# EAGLE design pd84004 (EAGLE 5.12)
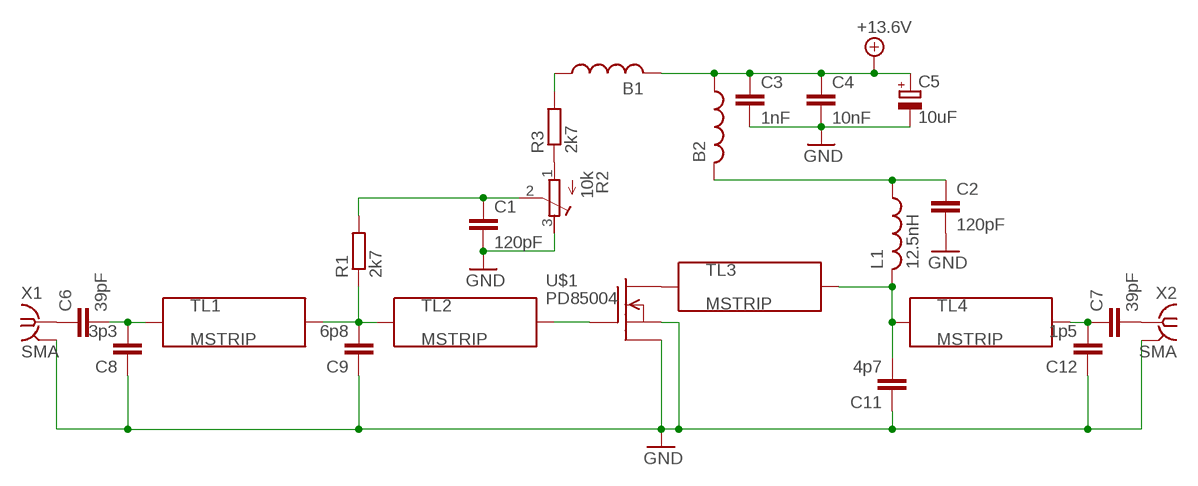
[diagram p0: schematic, sheet 1]

## Parts
B1  L-US0204/5  [0204/5]
B2  L-US0204/5  [0204/5]
C1  120pF  C-EUC0603  [C0603]
C2  120pF  C-EUC0603  [C0603]
C3  1nF  C-EUC0603  [C0603]
C4  10nF  C-EUC0603  [C0603]
C5  10uF  CPOL-EUSANYO_SMD_B6  [SANYO-OSCON_SMD_B6]
C6  39pF  C-EUC0603  [C0603]
C7  39pF  C-EUC0603  [C0603]
C8  3p3  C-EUC0603  [C0603]
C9  6p8  C-EUC0603  [C0603]
C11  4p7  C-EUC0603  [C0603]
C12  1p5  C-EUC0603  [C0603]
L1  12.5nH  L_0805  [0805]
R1  2k7  R-EU_R0805  [R0805]
R2  10k  R-TRIMM3214W  [RTRIM3214W]
R3  2k7  R-EU_R0805  [R0805]
TL1  MSTRIP  [TRLINE2]
TL2  MSTRIP  [TRLINE2]
TL3  MSTRIP  [TRLINE2]
TL4  MSTRIP  [TRLINE2]
U$1  PD85004  PD84004  [SOT-89]
X1  SMA  SMA-142-0701-881/886  [J502-ND-142-0701-881/886]
X2  SMA  SMA-142-0701-881/886  [J502-ND-142-0701-881/886]

## Nets
+12V: B1.2 B2.1 C3.1 C4.1 C5.+ ; supply symbol labelled +13.6V
GND: C1.2 C2.2 C3.2 C4.2 C5.- C8.1 C9.1 C11.1 C12.1 R2.3(A) U$1.2(S) U$1.2@1(S1) X1.G@1(GND) X2.G@1(GND)
N$1: C6.1 X1.1
N$2: B2.2 C2.1 L1.1
N$3: C7.2 X2.1
N$4: TL2.P$2 U$1.1(G)
N$5: C1.1 R1.2 R2.2(S)
N$6: C11.2 L1.2 TL3.P$2 TL4.P$1
N$7: R2.1(E) R3.1
N$8: B1.1 R3.2
N$18: C6.2 C8.2 TL1.P$1
N$19: C9.2 R1.1 TL1.P$2 TL2.P$1
N$20: C7.1 C12.2 TL4.P$2
N$21: TL3.P$1 U$1.3(D)

## Power pins joined to a net without a drawn wire
GND: X1.G@2(GND) X1.G@3(GND) X1.G@4(GND) X2.G@2(GND) X2.G@3(GND) X2.G@4(GND)

## Library data of the parts
B1 B2 = rcl:L-US: INDUCTOR, American symbol
C1-C4 C6-C9 C11 C12 = rcl:C-EU: CAPACITOR, European symbol
C5 = rcl:CPOL-EU: POLARIZED CAPACITOR, European symbol
L1 = g4bao:L_0805
R1 R3 = rcl:R-EU_: RESISTOR, European symbol
R2 = rcl:R-TRIMM: Trimm resistor
TL1-TL4 = g4bao1:MSTRIP
U$1 = g4bao1:PD84004
X1 X2 = con-coax:SMA-: SMA 50 Ohm End Launch Jack Receptacle - Round Contact Johnson Components Source: www.johnsoncomponents.com .. J502-ND.pdf

## Board
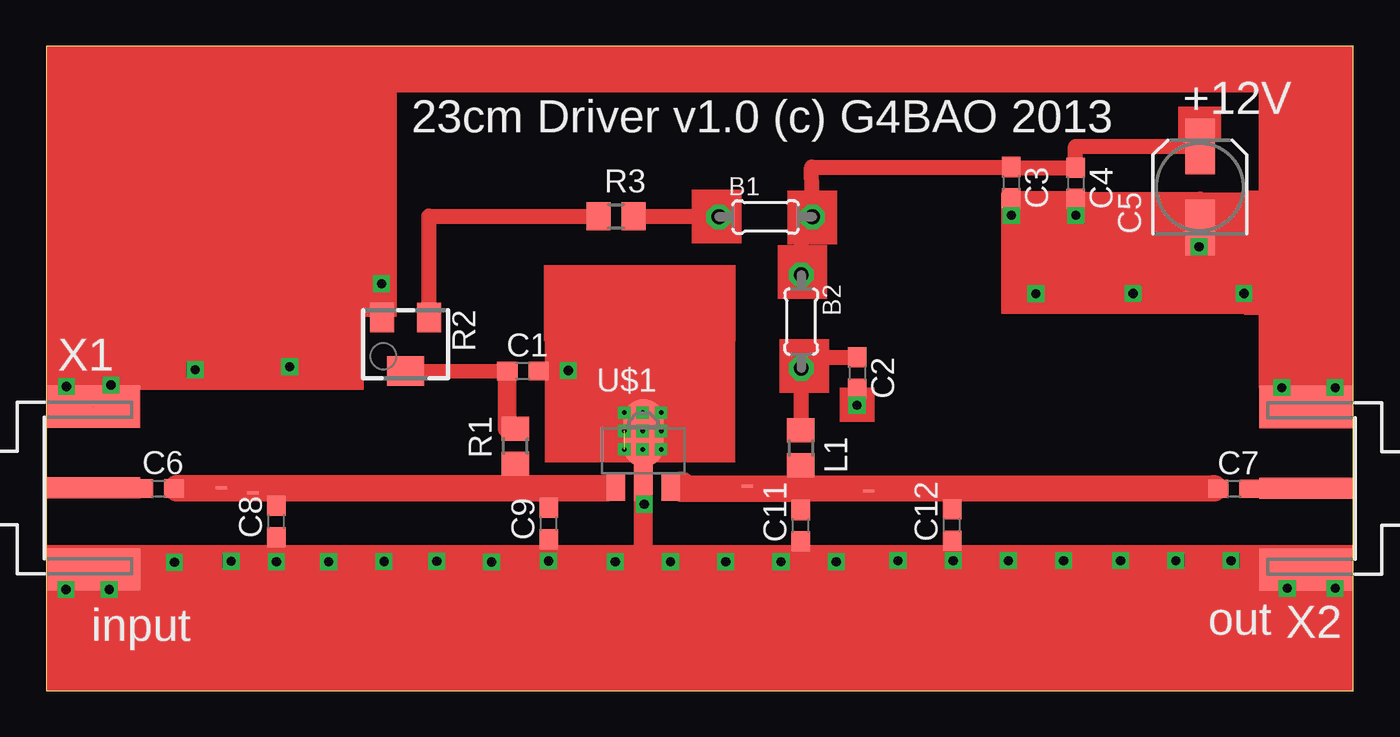
[diagram p1: board, top side]
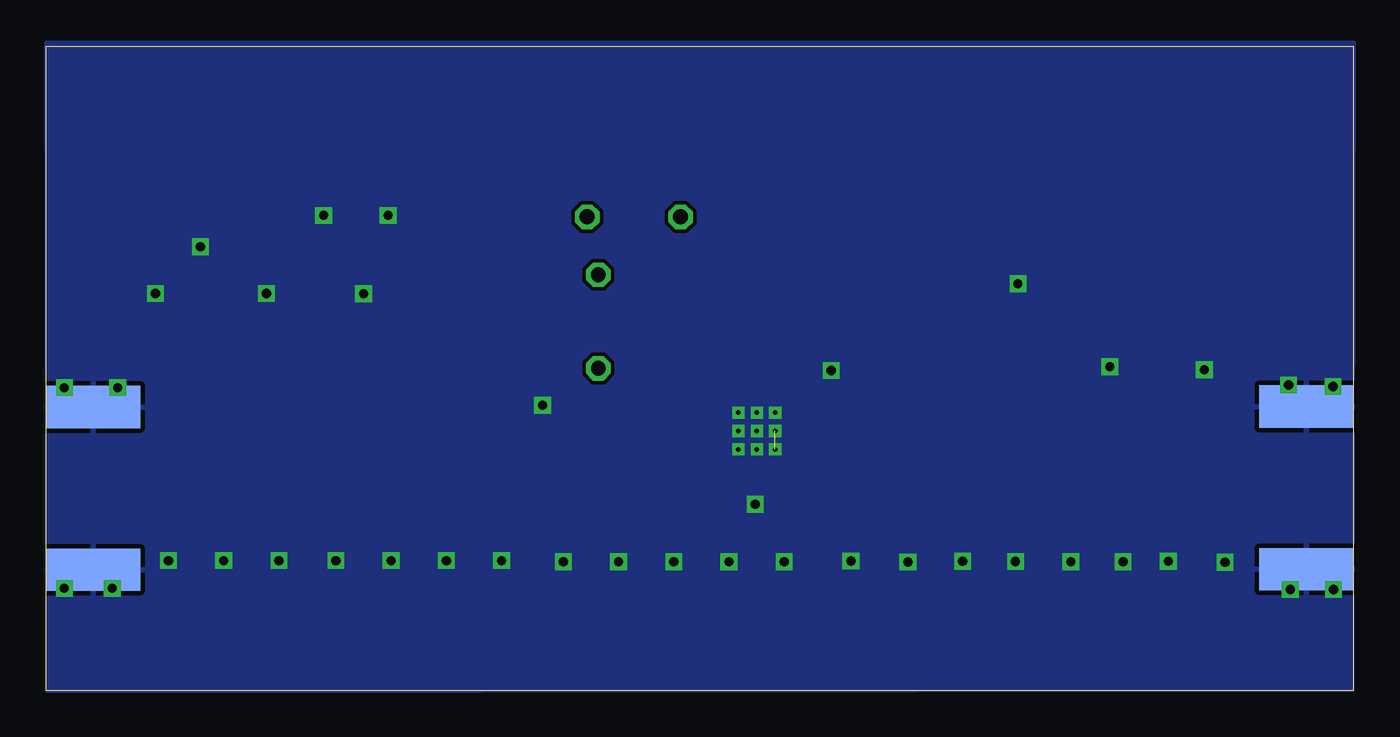
[diagram p2: board, bottom side, seen from below]

Size 71.01 x 35 mm. Coordinates in mm from the lower left corner, seen from the top.
Outline: 0.01,0 71.01,0 71.01,35 0.01,34.99 0.01,0
Copper layers (1*16): Top 0.035mm / dielectric 1.5mm / Bottom 0.035mm
Design rules "default": minimum track width 10mil, minimum drill 24mil, track to track 8mil, track to pad 8mil, pad to pad 8mil, via to via 8mil, smd to smd 8mil, copper to edge 0mil, drill to drill 8mil, minimum pad ring 10mil, minimum via ring 8mil, stop-mask expansion 4mil, vias tented up to drill 0mil, thermal gap 10mil

### Footprints (pad centres in the part's own frame; a part is rotated, then mirrored left to right if it is on the bottom)
0204/5 = drill 0.813 octagon: 1 -2.54,0; 2 2.54,0
C0603 = smd 1.1 x 1: 1 -0.85,0; 2 0.85,0
SANYO-OSCON_SMD_B6 = smd 3 x 1.6: + 2.2,0; - -2.2,0
0805 = smd 1.3 x 1.5: 1 -2.22,1.27; 2 -0.32,1.27
R0805 = smd 1.3 x 1.5: 1 -0.95,0; 2 0.95,0
RTRIM3214W = smd 1.3 x 1.6: 1 -1.275,-1.45; 3 1.275,-1.45 | smd 2 x 1.6: 2 0,1.45
TRLINE2 = smd 0.305 x 0.152: P$1 -3.139,1.555; P$2 -2.813,1.554
SOT-89 = smd 1 x 1.5: 1 -1.499,-1.981; 3 1.499,-1.981 | smd 1 x 2: 2 0,-1.727 | smd 2.2 x 3.7: 2@1 0,0.94
J502-ND-142-0701-881/886 = smd 5.08 x 1.143: 1 2.565,0 | smd 5.08 x 2.286: G@1 2.565,4.42; G@2 2.565,-4.42 | smd 5.08 x 2.286 bottom: G@3 2.565,4.42; G@4 2.565,-4.42

### Placement (x,y rotation side)
B1  39.08,25.72 0 top
B2  41.02,20.04 270 top
C1  25.9,17.36 0 top
C2  44.05,17.25 270 top
C3  52.41,27.58 270 top
C4  55.92,27.54 270 top
C5  62.67,27.35 90 top
C6  6.12,10.97 0 top
C7  64.52,10.96 0 top
C8  12.51,9.18 90 top
C9  27.31,9.07 90 top
C11  41,8.96 90 top
C12  49.21,9 90 top
L1  39.73,11.91 270 top
R1  25.49,13.28 90 top
R2  19.53,18.8 180 top
R3  30.96,25.76 0 top
TL1  14.21,9.19 0 top
TL2  12.51,9.46 0 top
TL3  41.07,9.54 0 top
TL4  47.65,9.29 0 top
U$1  32.44,13.04 0 top
X1  0,11.01 0 top
X2  71.01,10.98 180 top

### Tracks (layer width: path | path; a pad name or v marks a point on that pad's centre or on a via)
+12V
  Top 0.813: B2.1 41.02,25.72 B1.2 41.58,28.43 C3.1 52.41,28.39 C4.1 55.92,29.55 C5.+
GND  (via drill 0.25, 0.5, 0.5 pad 0.81)  (2 unrouted)
  Top 0.406: v15.35,7 15.07,7.02 16.01,7 16.82,7 | v39.92,7 41,7 C11.1 | v49.27,7.06 49.21,7.06 C12.1 | v18.22,22.1 18.15,22.1 18.15,23 | 68.42,16.45 v70.02,16.45 | 68.42,16.45 v67.12,16.45 | v67.42,5.55 68.4,5.55 68.4,5.97 | X2.G@1 64.37,6.56 v64.37,7.06 | 68.42,16.45 68.42,15.4 X2.G@4 68.4,15.4 68.4,15.35 68.35,15.35 68.35,22.6 | X1.G@4 3.03,6.56 v3.43,5.49 | X1.G@4 1.08,6.56 v1.08,5.49 | X1.G@4 2.63,6.56 2.63,6.87 2.69,6.87 2.69,6.85 6.92,6.85 v6.98,6.97 | C8.1 12.38,8.33 12.38,7.01 12.87,6.95 v12.51,7 | C9.1 27.29,8.22 v27.29,7.04 | 2.57,15.33 3.36,15.33 3.36,15.43 X1.G@1 2.57,15.33
  Top 0.813: C2.2 44.09,16.21 v44.05,15.49 | R2.3 18.15,23 18.13,23.7 18.02,23.7 | v62.63,24.11 69.73,22.6 68.35,22.6 62.71,22.6 62.71,25.15 C5.- 62.67,26.69 C4.2 55.92,26.73 C3.2 | C12.1 49.17,8.14 | v28.37,17.38 28.21,17.36 C1.2 | v32.49,10.12 32.44,8.16 U$1.2 U$1.2@1 | 16.82,7 16.82,6.1 | C11.1 41.07,8.11 | X2.G@4 68.42,15.47 | 68.41,6.8 68.21,6.8 68.21,6.6 68.37,6.6 X2.G@1 68.4,5.97 68.37,5.55 v70.02,5.55 | X1.G@1 1.11,16.49 v1.11,16.52
  other vias: 46.27,7.06 3.53,16.59 55.93,25.81 52.43,25.81 58.37,7.06 10.06,7.02 18.35,7.01 30.92,7 33.92,7 36.92,7 42.92,7 52.27,7.06 55.27,7.06 61.37,7.06 8.1,17.43 13.23,17.58 53.76,21.55 65.07,21.56 59.05,21.56 24.2,6.99 21.22,7.02 31.41,15.1 32.41,15.1 33.41,15.1 33.41,14.1 32.41,14.1 31.41,13.1 32.41,13.1 33.41,13.1 31.41,14.1
  pour Bottom: 0.01,35.16 70.98,35.16 70.9,0 0.08,0.08
N$1
  Top 0.813: X1.1 2.31,10.97 C6.1
N$2
  Top 0.813: L1.1 41.02,14.13 B2.2 41.02,18.1 C2.1
N$3
  Top 0.406: X2.1 65.3,10.98 C7.2
N$4
  Top 0.406: 7.13,10.97 7.13,10.98 9.69,10.98 TL2.P$2
  Top 0.813: 25.51,10.98 25.5,10.98 | 16.82,10.98 25.21,10.98 25.21,12.33
  Top 1.016: U$1.1 30.94,10.98 30.43,10.98 30.05,10.98
  Top 1.436: 7.13,10.98 25.21,10.98 25.51,10.98 30.43,10.98
N$5
  Top 0.406: 25.05,14.23 R1.2
  Top 0.813: C1.1 R2.2
  Top 1.016: C1.1 25.05,14.23
N$6
  Top 0.406: 41.01,11.09 TL3.P$2 | 41.01,11 41.01,11.09 | L1.2 41.01,11.09 | 41.21,10.9 44.51,10.9 TL4.P$1
  Top 0.813: 34.52,10.97 34.52,10.8 41.01,10.8 | 41.01,10.8 41.01,11 | 41.01,10.8 C11.2 | 41,10.87 41.21,10.97 41.21,10.9 49.21,10.9 49.21,9.84
  Top 1.016: 34.52,11.17 33.94,11.17 | 63.42,10.99 63.4,10.87
  Top 1.436: 34.52,11.17 34.52,10.97 41.21,10.97 63.42,10.99
N$7
  Top 0.813: R2.1 20.8,25.76 R3.1
N$8
  Top 0.813: B1.1 37.18,25.76 R3.2
N$18
  Top 0.406: 7.27,11.1 11.07,11.1 TL1.P$1 12.54,10.74 | 12.54,10.74 16.82,10.74 | C8.2 12.54,10.03 12.54,10.74
  Top 1.016: C6.2 7.27,11.1
N$19
  Top 0.406: R1.1 25.25,12.33 26.42,10.97 | 26.42,10.97 C9.2 | TL2.P$1 11.4,10.92 | 11.4,10.92 TL1.P$2 | 11.4,10.92 26.42,10.92 26.42,10.97
N$20
  Top 0.406: TL4.P$2 49.13,10.84 49.13,10.87 49.21,10.87 C12.2 49.16,9.84 49.16,11.04 63.67,11.04 C7.1
N$21
  Top 0.406: U$1.3 37.93,11.06 TL3.P$1
(copper drawn outside any net)
  shapes: Top area x20

### Text on the board
tNames: +12V | 23cm Driver v1.0 (c) G4BAO 2013 | input | out